# Altium schematic sheet PDB_schematic.SchDoc
size 431 x 279 mm; Organization: ORGANIZATION; Address1: ADDRESS 1; Address2: ADDRESS 2; Address3: ADDRESS 3; Address4: ADDRESS 4; Revision: -; SheetNumber: 1; SheetTotal: 1; ENG_APP_DATE: --/--/--; DSN_APP_DATE: --/--/--; CHK_APP_DATE: --/--/--
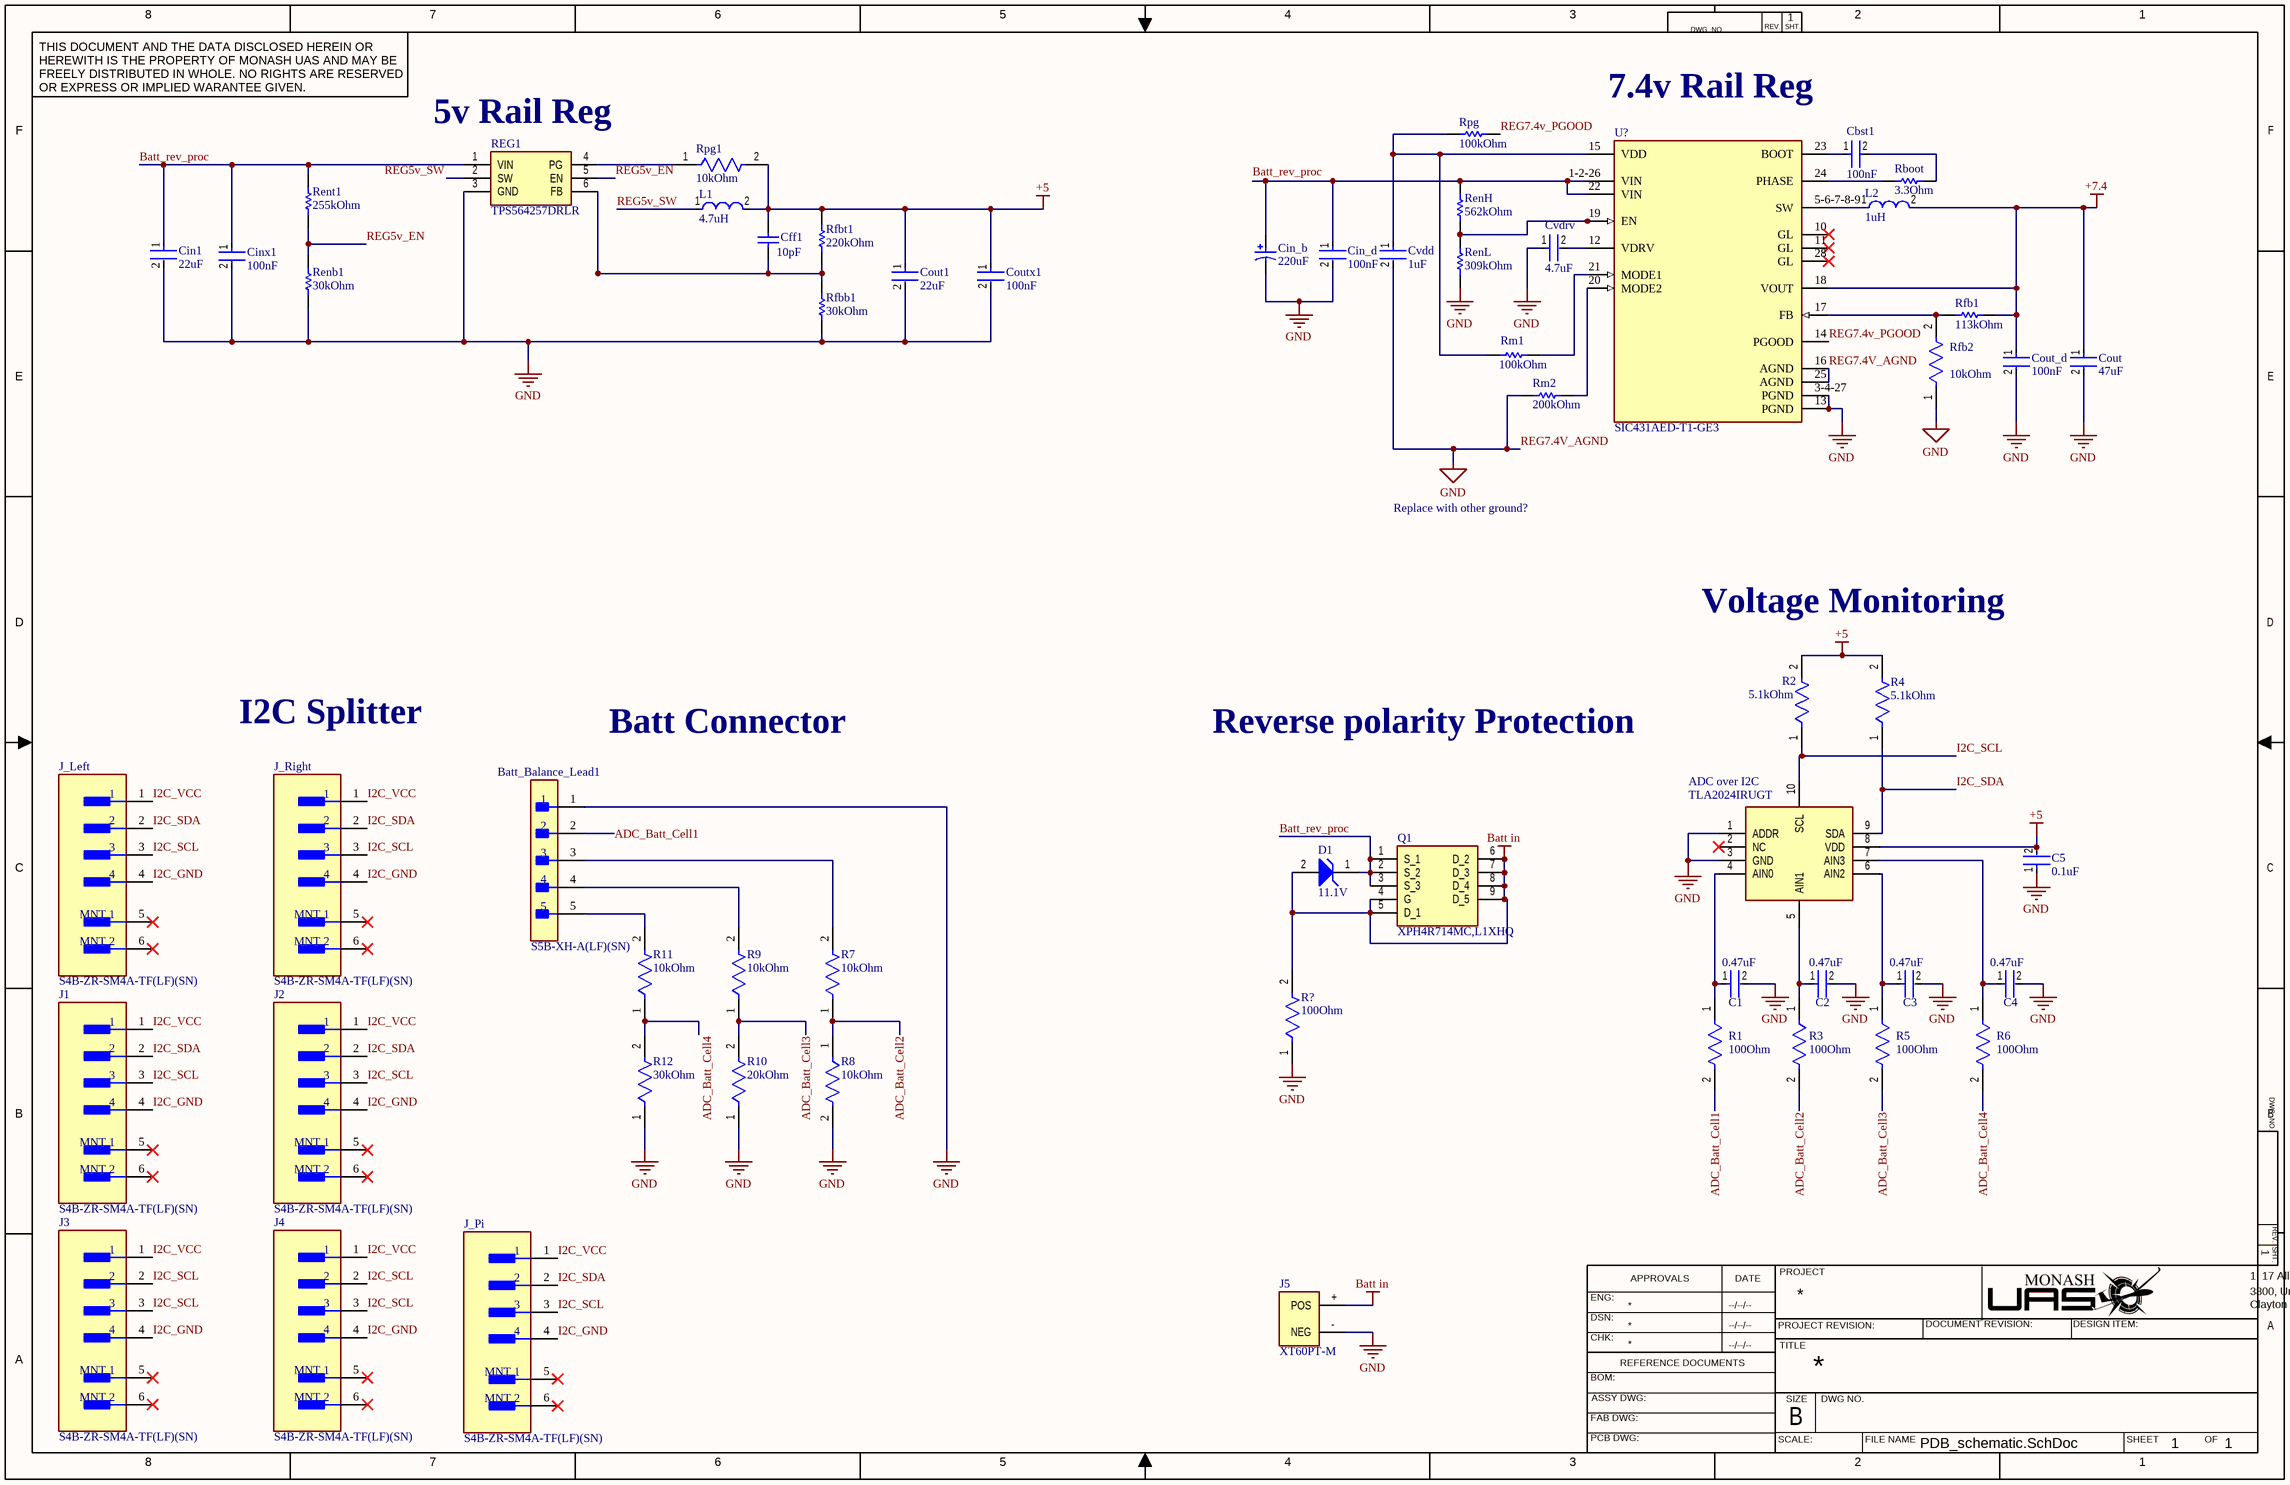
[diagram p0: PDB_schematic.SchDoc]

## Parts
ADC_over_I2C  TLA2024IRUGT  [ADS1018IRUGT]
Batt_Balance_Lead1  S5B-XH-A(LF)(SN)  [FP-S5B-XH-A_LF_SN-MFG]
C1  0.47uF  [FP-GRM188-0_1-e0_2_0_5-IPC_B]
C2  0.47uF  [FP-GRM188-0_1-e0_2_0_5-IPC_B]
C3  0.47uF  [FP-GRM188-0_1-e0_2_0_5-IPC_B]
C4  0.47uF  [FP-GRM188-0_1-e0_2_0_5-IPC_B]
C5  0.1uF  [FP-C0603-CJ-MFG]
Cbst1  100nF  [FP-CC0805-0_85-MFG]
Cff1  10pF  [CAPC1608X90X40ML10T20]
Cin1  22uF  [FP-C2012-125-0_2-MFG]
Cin_b  220uF  [PNSC-EEE-FK1E221P_N]
Cin_d  100nF  [FP-CC0805-0_85-MFG]
Cinx1  100nF  [FP-CC0805-0_85-MFG]
Cout  47uF  [FP-GRM188-0_2-IPC_B]
Cout1  22uF  [FP-C2012-125-0_2-MFG]
Cout_d  100nF  [FP-CC0805-0_85-MFG]
Coutx1  100nF  [FP-CC0805-0_85-MFG]
Cvdd  1uF  [FP-0603-L_1_6_0_15-W_0_8-IPC_C]
Cvdrv  4.7uF  [FP-C0603-CG-MFG]
D1  11.1V  [ONSC-SMB-2-403A-03_J_V]
J1  S4B-ZR-SM4A-TF(LF)(SN)  [FP-S4B-ZR-SM4A-TF_LF_SN-MFG]
J2  S4B-ZR-SM4A-TF(LF)(SN)  [FP-S4B-ZR-SM4A-TF_LF_SN-MFG]
J3  S4B-ZR-SM4A-TF(LF)(SN)  [FP-S4B-ZR-SM4A-TF_LF_SN-MFG]
J4  S4B-ZR-SM4A-TF(LF)(SN)  [FP-S4B-ZR-SM4A-TF_LF_SN-MFG]
J5  XT60PT-M  [XT60PT-M]
J_Left  S4B-ZR-SM4A-TF(LF)(SN)  [FP-S4B-ZR-SM4A-TF_LF_SN-MFG]
J_Pi  S4B-ZR-SM4A-TF(LF)(SN)  [FP-S4B-ZR-SM4A-TF_LF_SN-MFG]
J_Right  S4B-ZR-SM4A-TF(LF)(SN)  [FP-S4B-ZR-SM4A-TF_LF_SN-MFG]
L1  4.7uH  [FP-MLZ1608-IPC_A]
L2  1uH  [FP-CBMF1608-MFG]
Q1  XPH4R714MC,L1XHQ  [XPH4R714MC]
R1  100Ohm  [FP-ERA3A-IPC_B]
R2  5.1kOhm  [FP-CRCW0603-e3-IPC_C]
R3  100Ohm  [FP-ERA3A-IPC_B]
R4  5.1kOhm  [FP-CRCW0603-e3-IPC_C]
R5  100Ohm  [FP-ERA3A-IPC_B]
R6  100Ohm  [FP-ERA3A-IPC_B]
R7  10kOhm  [FP-ERA3A-IPC_C]
R8  10kOhm  [FP-ERA3A-IPC_C]
R9  10kOhm  [FP-ERA3A-IPC_C]
R10  20kOhm  [FP-ERA3A-MFG]
R11  10kOhm  [FP-ERA3A-IPC_C]
R12  30kOhm  [FP-ERJ3EK-IPC_A]
R?  100Ohm  [FP-ERA3A-IPC_B]
Rboot  3.3Ohm  [RESC1608X55X30NL15T15]
REG1  TPS564257DRLR  [SOTFL50P160X60-6N]
Renb1  30kOhm  [RESC1609X50X30LL10T20]
RenH  562kOhm  [RESC1608X55X30NL15T15]
RenL  309kOhm  [RESC1608X55X30LL15T15]
Rent1  255kOhm  [RESC1608X55X30ML15T15]
Rfb1  113kOhm  [RESC1608X55X30LL15T15]
Rfb2  10kOhm  [FP-AC0603-MFG]
Rfbb1  30kOhm  [RESC1609X50X30LL10T20]
Rfbt1  220kOhm  [RESC1608X55X30LL15T15]
Rm1  100kOhm  [RESC1608X55X30NL15T15]
Rm2  200kOhm  [RESC1608X55X25LL10T15]
Rpg  100kOhm  [RESC1608X55X30NL15T15]
Rpg1  10kOhm  [FP-AC0603-MFG]
U?  SIC431AED-T1-GE3  [FP-T22-0442-MFG]

## Nets
+5: ADC_over_I2C.8(VDD) C5.2 Cff1.2 Cout1.1 Coutx1.1 L1.2 R2.2 R4.2 Rfbt1.2 Rpg1.2
+7.4: Cout.1 Cout_d.1 L2.2 Rfb1.2 U?.18(VOUT)
Batt in: D1.2(A) J5.+(POS) Q1.4(G) Q1.5(D_1) Q1.6(D_2) Q1.7(D_3) Q1.8(D_4) Q1.9(D_5) R?.2
REG7.4V_AGND: ADC_over_I2C.1(ADDR) ADC_over_I2C.3(GND) Batt_Balance_Lead1.1 C1.2 C2.2 C3.2 C4.2 C5.1 Cin1.2 Cin_b.2 Cin_d.2 Cinx1.2 Cout.2 Cout1.2 Cout_d.2 Coutx1.2 Cvdd.2 Cvdrv.1 J5.-(NEG) R8.2 R10.1 R12.1 R?.1 REG1.3(GND) Renb1.1 RenL.1 Rfb2.1 Rfbb1.1 Rm2.1 U?.3-4-27(PGND) U?.13(PGND) U?.16(AGND) U?.25(AGND)  [also labelled GND]
ADC_Batt_Cell1: Batt_Balance_Lead1.2 R1.2
ADC_Batt_Cell2: R3.2 R7.1 R8.1
ADC_Batt_Cell3: R5.2 R9.1 R10.2
ADC_Batt_Cell4: R6.2 R11.1 R12.2
Batt_rev_proc: Cin1.1 Cinx1.1 D1.1(K) Q1.1(S_1) Q1.2(S_2) Q1.3(S_3) REG1.1(VIN) Rent1.2
I2C_GND: J1.4 J2.4 J3.4 J4.4 J_Left.4 J_Pi.4 J_Right.4
I2C_SCL: ADC_over_I2C.10(SCL) J1.3 J2.3 J3.2 J3.3 J4.2 J4.3 J_Left.3 J_Pi.3 J_Right.3 R2.1
I2C_SDA: ADC_over_I2C.9(SDA) J1.2 J2.2 J_Left.2 J_Pi.2 J_Right.2 R4.1
I2C_VCC: J1.1 J2.1 J3.1 J4.1 J_Left.1 J_Pi.1 J_Right.1
REG5v_EN: REG1.5(EN) Renb1.2 Rent1.1
REG5v_SW: L1.1 REG1.2(SW)
REG7.4v_PGOOD: Rpg.2 U?.14(PGOOD)
NetADC_over_I2C_4: ADC_over_I2C.4(AIN0) C1.1 R1.1
NetADC_over_I2C_5: ADC_over_I2C.5(AIN1) C2.1 R3.1
NetADC_over_I2C_6: ADC_over_I2C.6(AIN2) C3.1 R5.1
NetADC_over_I2C_7: ADC_over_I2C.7(AIN3) C4.1 R6.1
NetBatt_Balance_Lead1_3: Batt_Balance_Lead1.3 R7.2
NetBatt_Balance_Lead1_4: Batt_Balance_Lead1.4 R9.2
NetBatt_Balance_Lead1_5: Batt_Balance_Lead1.5 R11.2
NetCbst1_1: Cbst1.1 U?.23(BOOT)
NetCbst1_2: Cbst1.2 Rboot.2
NetCff1_1: Cff1.1 REG1.6(FB) Rfbb1.2 Rfbt1.1
NetCin_b_1: Cin_b.1 Cin_d.1 RenH.2 U?.1-2-26(VIN) U?.22(VIN)
NetCvdd_1: Cvdd.1 Rm1.1 Rpg.1 U?.15(VDD)
NetCvdrv_2: Cvdrv.2 U?.12(VDRV)
NetL2_1: L2.1 U?.5-6-7-8-9(SW)
NetRboot_1: Rboot.1 U?.24(PHASE)
NetREG1_4: REG1.4(PG) Rpg1.1
NetRenH_1: RenH.1 RenL.2 U?.19(EN)
NetRfb1_1: Rfb1.1 Rfb2.2 U?.17(FB)
NetRm1_2: Rm1.2 U?.21(MODE1)
NetRm2_2: Rm2.2 U?.20(MODE2)

Not connected (* = marked no-connect by the designer): ADC_over_I2C 2(NC)*; J1 5(MNT_1)* 6(MNT_2)*; J2 5(MNT_1)* 6(MNT_2)*; J3 5(MNT_1)* 6(MNT_2)*; J4 5(MNT_1)* 6(MNT_2)*; J_Left 5(MNT_1)* 6(MNT_2)*; J_Pi 5(MNT_1)* 6(MNT_2)*; J_Right 5(MNT_1)* 6(MNT_2)*; U? 10(GL)* 11(GL)* 28(GL)*

## Notes on the sheet
- (near REG1) 5v Rail Reg
- 7.4v Rail Reg
- Replace with other ground?
- Voltage Monitoring
- I2C Splitter
- Batt Connector
- Reverse polarity Protection
- Labels drawn without touching a wire or pin: Batt_rev_proc
- 8
- 7
- 6
- 5
- 4
- 3
- DWG. NO.
- REV.
- SHT.
- 2
- 1
- THIS DOCUMENT AND THE DATA DISCLOSED HEREIN OR HEREWITH IS THE PROPERTY OF MONASH UAS AND MAY BE FREELY DISTRIBUTED IN WHOLE. NO RIGHTS ARE RESERVED OR EXPRESS OR IMPLIED WARANTEE GIVEN.
- F
- E
- D
- C
- B
- ENG:
- APPROVALS
- DATE
- PROJECT
- 1, 17 Alliance Ln
- 3800, University Pl
- A
- DSN:
- CHK:
- REFERENCE DOCUMENTS
- PROJECT REVISION:
- TITLE
- DOCUMENT REVISION:
- DESIGN ITEM:
- Clayton VIC 3168
- BOM:
- FAB DWG:
- PCB DWG:
- ASSY DWG:
- SCALE:
- SIZE
- DWG NO.
- FILE NAME
- SHEET
- OF

## Library data of the parts
ADC_over_I2C = TLA2024IRUGT: Integrated Circuit; Manufacturer_Name: Texas Instruments; Datasheet Link: http://www.ti.com/lit/ds/sbas846/sbas846.pdf; Height: 0.4mm; Manufacturer_Part_Number: TLA2024IRUGT; Mouser Part Number: 595-TLA2024IRUGT; Mouser Price/Stock: https://www.mouser.co.uk/ProductDetail/Texas-Instruments/TLA2024IRUGT?qs=chTDxNqvsylxt6cbA39OGw%3D%3D; Arrow Part Number: TLA2024IRUGT; Arrow Price/Stock: https://www.arrow.com/en/products/tla2024irugt/texas-instruments?region=nac
Batt_Balance_Lead1 = CMP-17439-000302-1: CONN HEADER R/A 5POS 2.5MM; Contact Resistance: 10mR; Voltage Rating: 250V; Number of Contacts: 5; Current Rating: 3A; Insulation Resistance: 1GR; Wire/Cable Gauge: 22AWG; Number of Rows: 1; Contact Plating: Tin; Fastening Type: Detent; Contact Finish - Mating: TIN; Contact Material: Brass; Lead Free: Lead Free; Connector Type: Header; REACH SVHC: No SVHC; Insulation Color: Natural; Orientation: Right Angle; Contact Type: Male Pin; Pitch: 2.5mm; Contact Shape: Square; Series: XH; Color: Natural; Lead Pitch: 2.5mm; Mount: Through Hole; Termination: Solder; Max Operating Temperature: 85°C; Number of Positions: 5; Flammability Rating: UL94 V-0; Min Operating Temperature: -25°C; Packaging: Bulk; Voltage Rating (AC): 250V; Insulation Material: Nylon
C1-C4 = CMP-2006-02860-2: Chip Multilayer Ceramic Capacitors for General Purpose, 0603, 0.47uF, X7R, 15%, 10%, 16V; Capacitance: 470nF; Material: Ceramic; Termination: SMD/SMT; Case Code (Imperial): 0603; Height: 0.8mm; Dielectric: X7R; Length: 1.6mm; Packaging: Tape and Reel; Mount: Surface Mount; Thickness: 0.035inch; Voltage Rating (DC): 16V; Case Code (Metric): 1608; REACH SVHC: No SVHC; Depth: 0.8mm; Number of Pins: 2; Max Operating Temperature: 125°C; Min Operating Temperature: -55°C; Width: 0.8mm; Voltage: 16V; Lead Free: Lead Free; Voltage Rating: 16V; Package Quantity: 1; Case/Package: 0603; Tolerance: 10%
C5 = CMP-2006-03300-2: CAP CER 0.1UF 50V X7R 0603; Manufacturer Part Number: C0603X104K5RACTU; Manufacturer: Kemet; Capacitance: 100nF; Material: Ceramic; Tolerance: 10%; Value: 100nF; Temperature Coefficient: 15%; Temperature Range High: +125°C; Temperature Range Low: -55°C; Voltage: 50V; ComponentLink2Description: Datasheet; RoHS: TRUE; ComponentLink2URL: https://content.kemet.com/datasheets/KEM_C1013_X7R_FT-CAP_SMD.pdf; Device Class L3: Ceramic Capacitors; Device Class L2: Capacitors; Package: C0603-CJ; Height: 0.95mm; Device Class L1: Passive Components; Temperature Characteristic: X7R; Lead Free: Yes; Digikey Description: CAP CER 0.1UF 50V X7R 0603; Automotive: No; Mouser Description: Capacitor; Ceramic; Cap 0.1uF; Tol+10%; SMT; Flexible Termination; Vol-Rtg 50V; TR; Temperature: -55°C to +125°C; Octopart: https://octopart.com/c0603x104k5ractu-kemet-9145062; Category: Cap; Voltage Rating: 50V; Ipc Land Pattern Name: CAPC16080X80
Cbst1 Cin_d Cinx1 Cout_d Coutx1 = CMP-1036-04410-2: CAP CER 0.1UF 25V X7R 0805; Manufacturer Part Number: CC0805KRX7R8BB104; Manufacturer: Yageo; Tolerance: 0.1; ComponentLink2URL: http://www.yageo.com/documents/recent/UPY-GPHC_Y5V_6.3V-to-50V_8.pdf; Category: Cap; Mouser Description: Multilayer Ceramic Capacitors MLCC - SMD/SMT 100nF 25V X7R 10%; Device Class L1: Passive Components; Footprint Url: http://www.yageo.com/exep/pages/download/literatures/UPY-C_GEN_24.pdf; Height: 0.95mm; Material: Ceramic; Digikey Description: CAP CER 0.1UF 25V X7R 0805; Lead Free: Yes; Temperature Range High: +85°C; Temperature: -30°C to +85°C; Ipc Land Pattern Name: CAPC200125X85; Value: 100 nF; Capacitance: 100 nF; Automotive: No; Octopart: https://octopart.com/cc0805krx7r8bb104-yageo-39467766; Device Class L2: Capacitors; Temperature Characteristic: X7R; Voltage Rating: 25 V; ComponentLink2Description: Datasheet; Temperature Range Low: -30°C; Device Class L3: Ceramic Capacitors; RoHS: TRUE; Package: CC0805-0.85
Cff1 = CMP-2100-03593-1: Chip Capacitor, 10 pF, +/- 5%, 50 V, -55 to 125 degC, 0603 (1608 Metric), RoHS, Tape and Reel; Manufacturer: Yageo; Insulation Resistance: 100GR; Voltage Rating: 50V; Temperature Coefficient: 30ppm/degC; Dielectric: C0G; Radiation Hardening: No; Mount: SurfaceMount; Width: 0.031inch; Composition: Ceramic; Package Description: 2-Pin Surface Mount Device, Body 1.6 x 0.8 mm; Min Operating Temperature: -55degC; Case Code (Metric): 1608; Datasheet URL: http://www.yageo.com/documents/recent/UPY-GP_NP0_16V-to-50V_14.pdf; Termination: SMD/SMT; REACH SVHC: NoSVHC; Case/Package: 0603; RoHSCompliant: True; Packaging: TapeandReel; Max Operating Temperature: 125degC; Voltage: 50V; Package Quantity: 1; Manufacturer URL: http://www.yageo.com/; Tolerance: 5%; Capacitance: 10pF; Height: 0.8mm; Depth: 0.8mm; Thickness: 0.035inch; Case Code (Imperial): 0603; Length: 1.6mm; Package Reference: 0603; Voltage Rating (DC): 50V; Lead Free: LeadFree; Number of Pins: 2; Datasheet Version: Rev. 14, 07/2016
Cin1 Cout1 = CMP-08246-000038-3: CAP CER 22UF 25V X5R 0805; Manufacturer Lifecycle Status: PRODUCTION; NexarPartId: 26013714; Capacitance: 22µF; Dielectric Material: Ceramic; Tolerance: 20%; Voltage Rating: 25V; Schedule B: 8532240020, 8532240020; Max Width: 1.45mm; Voltage Rating (DC): 25V; Depth: 1.25mm; Min Length: 1.8mm; Dielectric: X5R; Weight: 5.499807mg; Case Code (Imperial): 0805; Packaging: Cut Tape (CT); Min Operating Temperature: -55°C; Height: 1.25mm; REACH SVHC: No SVHC; Thickness: 1.4478mm; Min Width: 1.05mm; Length: 2mm; Case Code (Metric): 2012; Lifecycle Status: Production; Termination: SMD/SMT; Max Length: 2.2mm; Mount: Surface Mount; Width: 1.25mm; RoHS: Compliant; Lead Free: Lead Free; Material: Ceramic; Composition: Ceramic; Max Operating Temperature: 85°C; Case/Package: 0805
Cin_b = CMP-1665-00017-3: Aluminum Electrolytic Capacitor, 220 uF, +/- 20%, 25 V, -55 to 105 degC, 2-Pin CAPAE, RoHS, Tape and Reel; Manufacturer: Panasonic; Voltage Rating: 25 V; ComponentLink2URL: http://industrial.panasonic.com/cdbs/www-data/pdf/RDE0000/ABA0000C1181.pdf; Height: 10.2 mm; Max Operating Temperature: 105 degC; PackageReference: EEE-FK1E221P; ComponentLink1Description: Manufacturer URL; ComponentLink1URL: http://www.panasonic.com/; Mount: Surface Mount; REACH SVHC: No SVHC; Min Operating Temperature: -55 degC; ComponentLink2Description: Datasheet; DatasheetVersion: 03/2016; Length: 10.2 mm; RoHSCompliant: true; Packaging: Tape and Reel; Package Quantity: 500; Lead Pitch: 3.1 mm; Pins: 2; PackageDescription: 2-Pin Electrolytic Aluminum Capacitor, Body 8.3 x 8.3 mm; Mounting Technology: Surface Mount
Cout = CMP-2000-05444-2: Chip Multilayer Ceramic Capacitors for General Purpose, 0603, 47uF, X5R, 15%, 20%, 6.3V; Voltage Rating (DC): 6.3V; Thickness: 0.039inch; Case Code (Imperial): 0603; Packaging: Tape and Reel; Capacitance: 47uF; Width: 0.031inch; Dielectric: X5R; Max Operating Temperature: 85°C; Mount: Surface Mount; Case Code (Metric): 1608; Length: 0.063inch; Voltage Rating: 6.3V; Tolerance: 20%; Case/Package: 0603; Min Operating Temperature: -55°C
Cvdd = CMP-2000-07531-4: Ceramic Capacitor General Use 1uF ±10% 50V X7R 0603; Series: M; Width: 0.031inch; Mount: Surface Mount; Radiation Hardening: No; Voltage Rating (DC): 50V; Packaging: Tape and Reel; Termination: SMD/SMT; Depth: 0.8mm; Case Code (Metric): 1608; Case Code (Imperial): 0603; Height: 0.8mm; Voltage Rating: 50V; Package Quantity: 1; Halogen Free: Halogen Free; Dielectric: X7R; Min Operating Temperature: -55°C; Length: 1.6mm; Construction: Flat; Tolerance: 10%; Thickness: 0.037inch; Max Operating Temperature: 125°C; Case/Package: 0603; Capacitance: 1uF; RoHS Compliant: Yes
Cvdrv = CMP-2006-02256-2: CAP CER 4.7UF 6.3V X5R 0603; Manufacturer: Kemet; Manufacturer Part Number: C0603C475K9PACTU; Temperature Coefficient: 15%; Tolerance: 10%; Device Class L3: Ceramic Capacitors; RoHS: TRUE; Value: 4.7uF; Lead Free: Yes; ComponentLink2Description: Datasheet; Mouser Description: Multilayer Ceramic Capacitors MLCC - SMD/SMT 6.3volts 4.7uF X5R 10%; Package: C0603-CG; Digikey Description: CAP CER 4.7UF 6.3V X5R 0603; ComponentLink2URL: https://content.kemet.com/datasheets/KEM_C1006_X5R_SMD.pdf; Category: Cap; Temperature Range Low: -55°C; Capacitance: 4.7uF; Temperature: -55°C to +85°C; Octopart: https://octopart.com/c0603c475k9pactu-kemet-104242; Ipc Land Pattern Name: CAPC16080X80; Voltage Rating: 6.3V; Temperature Range High: +85°C; Material: Ceramic; Height: 0.9mm; Temperature Characteristic: X5R; Device Class L1: Passive Components; Automotive: No; Device Class L2: Capacitors
D1 = CMP-1061-00396-1: 600 W Peak Power Zener Transient Voltage Suppressor, Unidirectional, 2-Pin SMB, Pb-Free, Tape and Reel; PartNumber: P6SMB13AT3G; Manufacturer: On Semiconductor; PPK Max (W): 600; IR Max (uA): 5; V(BR) Typ (V): 13.05; ComponentLink2Description: Datasheet; Direction: Unidirectional; PackageReference: SMB-2-403A-03_J; DatasheetVersion: Rev. J; PackageDescription: 2-Pin Small Molded Package, J-Bend Lead, Body 4.33 x 3.625 mm; Mounting Technology: Surface Mount; ComponentLink1Description: Manufacturer URL; ComponentLink1URL: http://www.onsemi.com/; ComponentLink3Description: Package Specification; ComponentLink3URL: http://www.onsemi.com/pub_link/Collateral/P6SMB6.8AT3-D.PDF; PackageVersion: Rev. J, 07/2012; RoHS: Pb-Free; Packing: Tape and Reel; ComponentLink2URL: http://www.onsemi.com/pub_link/Collateral/P6SMB6.8AT3-D.PDF
J1-J4 J_Left J_Pi J_Right = CMP-17439-000081-1: CONN HEADER SMD R/A 4POS 1.5MM; Gender: Male; Max Current Rating: 1A; Max Voltage Rating (AC): 50V; Number of Contacts: 4; Contact Resistance: 30mR; Pitch: 1.5mm; Depth: 6.5mm; Current Rating: 1A; Packaging: Tape and Reel; Contact Shape: Circular; Voltage Rating: 50V; Insulation Material: Nylon; Color: Natural; Contact Plating: Copper; Width: 3.5mm; Orientation: Right Angle; Length: 9mm; Number of Rows: 1; Lead Free: Lead Free; Insulation Color: Natural; Flammability Rating: UL94 V-0; Housing Color: Beige; Min Operating Temperature: -25°C; Housing Material: Polyamide; Contact Type: Male Pin; Max Operating Temperature: 85°C; Number of Positions: 4; Connector Type: Header; Mount: Surface Mount; Termination: Solder; Max Voltage Rating (DC): 50V; Contact Finish - Mating: TIN; Fastening Type: Detent; Height: 7.2mm; Series: ZH; Contact Material: Brass
J5 = XT60PT-M: Male SMT XT60 Connector
L1 = CMP-08253-000311-1: Shielded Multilayer Inductor 4.7uH ±20% 350mA 650mΩ SMD 0603; DC Resistance (DCR): 650mR; Test Frequency: 2MHz; Self Resonant Frequency: 80MHz; Core Material: Ferrite; Saturation Current: 120mA; Packaging: Tape and Reel; Width: 0.031inch; Height - Seated (Max): 0.037inch; Inductance: 4.7uH; Current Rating: 350mA; Max Operating Temperature: 125°C; Tolerance: 20%; Length: 0.063inch; Package Quantity: 4000; Case/Package: 0603; Case Code (Imperial): 0603; Min Operating Temperature: -55°C; Case Code (Metric): 1608; RoHS Compliant: Yes; Shielding: Shielded; Mount: Surface Mount
L2 = CMP-14484-000279-1: FIXED IND 1UH 770MA 117 MOHM SMD; Saturation Current: 290mA; Tolerance: 20%; Self Resonant Frequency: 100MHz; DC Resistance (DCR): 117mR; Core Material: Ferrite; Shielding: Unshielded; Test Frequency: 7.96MHz; Lead Free: Lead Free; Series: CBMF; Case Code (Metric): 1608; Military Standard: Not; Current Rating: 770mA; Resistor Type: Wirewound; Package Quantity: 1; Height - Seated (Max): 0.039inch; Inductance: 1uH; Min Operating Temperature: -40°C; Packaging: Tape and Reel; Radiation Hardening: No; Case/Package: 0603; RoHS Compliant: Yes; Max DC Current: 770mA; Height: 0.8mm; Inductance Tolerance: 20%; Width: 0.031inch; Termination: SMD/SMT; Case Code (Imperial): 0603; DC Current: 770mA; Mount: Surface Mount; Length: 1.6mm; Depth: 1mm; Halogen Free: Halogen Free; Max Operating Temperature: 105°C
Q1 = XPH4R714MC,L1XHQ: MOSFET (P-Channel); Manufacturer_Name: Toshiba; Datasheet Link: https://toshiba.semicon-storage.com/info/docget.jsp?did=66018&prodName=XPH4R714MC; Manufacturer_Part_Number: XPH4R714MC,L1XHQ; Mouser Part Number: 757-XPH4R714MC,L1XHQ; Mouser Price/Stock: https://www.mouser.co.uk/ProductDetail/Toshiba/XPH4R714MCL1XHQ?qs=7MVldsJ5Uay5UfLPuZnPLQ%3D%3D; Arrow Part Number: XPH4R714MC,L1XHQ; Arrow Price/Stock: https://www.arrow.com/en/products/xph4r714mcl1xhq/toshiba?region=nac
R1 R3 R5 R6 R? = CMP-2000-00870-2: RES SMD 100 OHM 0.1% 1/10W 0603; Voltage Rating: 75V; Power Rating: 100mW; Resistance: 100R; Temperature Coefficient: 25ppm/°C; Number of Terminations: 2; Case/Package: 0603; Termination: SMD/SMT; Number of Pins: 2; Size Code: 0603; Length: 1.6mm; Min Operating Temperature: -55°C; Resistor Type: Thin Film; Depth: 0.8mm; Military Standard: Not; Packaging: Tape and Reel; RoHS Compliant: Yes; Construction: Rectangular; Resistance Tolerance: 0.1%; Contact Plating: Tin; Width: 0.8mm; Mount: Surface Mount; Case Code (Metric): 1608; Max Operating Temperature: 155°C; Height: 0.45mm; Case Code (Imperial): 0603; Series: ERA-3A; Package Quantity: 5000; REACH SVHC: No SVHC; Tolerance: 0.1%; Max Power Dissipation: 100mW; Radiation Hardening: No; Technology: METAL FILM
R2 R4 = CMP-1012-00590-3: RES Thick Film, 5.1kΩ, 1%, 0.1W, 100ppm/°C, 0603; Power Rating: 100mW; Voltage Rating (DC): 75V; Resistance: 5.1kR; Width: 0.85mm; Depth: 0.85mm; Military Standard: Not; Package Quantity: 5000; Case Code (Metric): 1608; Length: 1.55mm; Weight: 7.1E-05oz; Packaging: Tape and Reel; Temperature Coefficient: 100ppm/°C; Case Code (Imperial): 0603; Lead Free: Lead Free; Radiation Hardening: No; Contact Plating: Tin; Composition: Thick Film; Max Operating Temperature: 155°C; Termination: SMD/SMT; Case/Package: 0603; Min Operating Temperature: -55°C; Tolerance: 1%; Voltage Rating: 75V; Mount: Surface Mount; Height: 0.45mm
R7-R9 R11 = CMP-2000-00874-2: RES SMD 10K OHM 0.1% 1/10W 0603; Voltage Rating (DC): 75V; Power Rating: 100mW; Resistance: 10kR; Temperature Coefficient: 25ppm/°C; Radiation Hardening: No; Width: 0.8mm; Depth: 0.8mm; Construction: Rectangular; Case Code (Metric): 1608; Package Quantity: 5000; Length: 1.6mm; Size Code: 0603; Case Code (Imperial): 0603; Termination: SMD/SMT; Contact Plating: Tin; Resistance Tolerance: 0.1%; Military Standard: Not; Packaging: Tape and Reel; Max Power Dissipation: 100mW; REACH SVHC: No SVHC; Series: ERA-3A; Voltage Rating: 75V; Lead Free: Lead Free; Technology: METAL FILM; RoHS Compliant: Yes; Max Operating Temperature: 155°C; Resistor Type: Thin Film; Min Operating Temperature: -55°C; Number of Pins: 2; Case/Package: 0603; Tolerance: 0.1%; Height: 0.45mm; Mount: Surface Mount; Number of Terminations: 2
R10 = CMP-2000-00946-2: RES SMD 20K OHM 0.1% 1/10W 0603; Max Power Dissipation: 100mW; Resistance: 20kR; Voltage Rating (DC): 75V; Temperature Coefficient: 25ppm/°C; Military Standard: Not; Tolerance: 0.1%; Weight: 7.1E-05oz; Length: 1.6mm; Max Operating Temperature: 155°C; Case Code (Imperial): 0603; Height: 0.45mm; RoHS Compliant: Yes; Case/Package: 0603; Construction: Rectangular; Number of Terminations: 2; Mount: Surface Mount; Contact Plating: Tin; Size Code: 0603; Series: ERA; Resistor Type: Thin Film; Resistance Tolerance: 0.1%; Power Rating: 100mW; Radiation Hardening: No; Lead Free: Lead Free; REACH SVHC: No SVHC; Termination: SMD/SMT; Width: 0.8mm; Number of Pins: 2; Min Operating Temperature: -55°C; Case Code (Metric): 1608; Voltage Rating: 75V; Package Quantity: 5000; Technology: THIN FILM; Packaging: Tape and Reel; Depth: 0.8mm
R12 = CMP-2000-00413-2: RES SMD 30K OHM 1% 1/10W 0603; Voltage Rating: 75V; Temperature Coefficient: 100ppm/°C; Max Power Dissipation: 100mW; Resistance: 30kR; Case Code (Imperial): 0603; Termination: SMD/SMT; Number of Terminations: 2; Series: ERJ; Features: Automotive AEC-Q200; Width: 0.031inch; Packaging: Tape and Reel; REACH SVHC: No SVHC; Lead Free: Lead Free; RoHS Compliant: Yes; Contact Plating: Tin; Case/Package: 0603; Tolerance: 1%; Mount: Surface Mount; Min Operating Temperature: -55°C; Resistor Type: Thick Film; Radiation Hardening: No; Resistance Tolerance: 1%; Construction: Rectangular; Power Rating: 100mW; Case Code (Metric): 1608; Size Code: 0603; Voltage Rating (DC): 75V; Military Standard: Not; Package Quantity: 1; Depth: 0.8mm; Length: 1.6mm; Height: 0.022inch; Max Operating Temperature: 155°C
Rboot = CMP-2000-00847-1: Part Number: ERJ-3RQF3R3V; Manufacturer: Panasonic
REG1 = TPS564257DRLR: Integrated Circuit; Manufacturer_Name: Texas Instruments; Datasheet Link: https://www.ti.com/lit/ds/symlink/tps564257.pdf?HQS=dis-mous-null-mousermode-dsf-pf-null-wwe&ts=1695023870951&ref_url=https%253A%252F%252Fwww.mouser.de%252F; Height: 0.6mm; Manufacturer_Part_Number: TPS564257DRLR; Mouser Part Number: 595-TPS564257DRLR; Mouser Price/Stock: https://www.mouser.co.uk/ProductDetail/Texas-Instruments/TPS564257DRLR?qs=ulEaXIWI0c8amaZvnJWTQQ%3D%3D
Renb1 Rfbb1 = CMP-2000-03223-1: Part Number: CRCW060330K0FKEA; Manufacturer: Vishay Dale
RenH = CMP-2000-00571-1: Part Number: ERJ-3EKF5623V; Manufacturer: Panasonic
RenL = CMP-2000-00422-1: Part Number: ERJ-3EKF3093V; Manufacturer: Panasonic
Rent1 = CMP-1012-00780-2: Part Number: ERJ-3EKF2553V; Manufacturer: Panasonic
Rfb1 = CMP-2000-00204-1: Manufacturer: Panasonic; Part Number: ERJ-3EKF1133V
Rfb2 Rpg1 = CMP-2000-04818-3: RES 10KΩ 1.00% 0.1W 0603; Power Rating: 100mW; Tolerance: 1%; Resistance: 10kR; Voltage Rating: 50V; Temperature Coefficient: 100ppm/°C; Ratings: AEC-Q200; Case Code (Metric): 1608; Max Power Dissipation: 100mW; Height: 0.45mm; Package Quantity: 1; Max Operating Temperature: 155°C; Resistor Type: Thick Film; Depth: 0.8mm; RoHS Compliant: Yes; Min Operating Temperature: -55°C; Packaging: Tape and Reel; Number of Terminations: 2; Length: 1.6mm; Features: Moisture Resistant; Military Standard: Not; Case Code (Imperial): 0603; Size Code: 0603; Termination: SMD/SMT; Case/Package: 0603; Mount: Surface Mount; Width: 0.8mm; Lead Free: Lead Free; Series: AC; Construction: Rectangular
Rfbt1 = CMP-2000-00338-2: Chip Resistor, 220 KOhm, +/- 1%, 0.1 W, -55 to 155 degC, 0603 (1608 Metric), RoHS, Tape and Reel; Frequency: 2450 MHz; Impedance: 50 Ohm; ComponentLink1Description: Manufacturer URL; ComponentLink2URL: http://industrial.panasonic.com/cdbs/www-data/pdf/RDA0000/AOA0000C86.pdf; REACH SVHC: No SVHC; Length: 3.2 mm; Mount: Surface Mount; Width: 1.6 mm; Pins: 2; Packaging: Tape and Reel; Max Operating Temperature: 80degC; ComponentLink1URL: http://www.panasonic.com/; RoHSCompliant: True; Radiation Hardening: No; PackageDescription: 2-Pin Surface Mount Device, Body 1.6 x 0.85 mm; Package Quantity: 3000; Height: 0.5 mm; PackageReference: 0603; ComponentLink2Description: Datasheet; DatasheetVersion: Apr-15; Min Operating Temperature: -20degC
Rm1 Rpg = CMP-2000-00705-1: Manufacturer: Panasonic; Part Number: ERJ-3GEYJ104V
Rm2 = CMP-2000-04252-1: Manufacturer: Yageo; Part Number: RC0603JR-07200KL
U? = CMP-00030-87948104-1: SIC431AED-T1-GE3 IC Reg Buck Adj 24A MLP44-24; Max Supply Voltage: 24V; Number of Outputs: 1; Max Junction Temperature (Tj): 125°C; Min Supply Voltage: 3V; Output Voltage: 20V; NexarPartId: 87948104; Min Operating Temperature: -40°C; Schedule B: 8542390000, 8542390000; RoHS: Non-Compliant; Max Operating Temperature: 125°C; Height: 800µm; Ambient Temperature Range High: 105°C; Output Current: 24A